# Altium schematic sheet led_array.schdoc
size 594 x 420 mm; Symbol: Drawing-Symbol_A4; Version: V1.0; Page Size: A4; Project: Bottle; @Update Date: 2026-04-30; @Create Date: 2026-03-28; Device: Drawing-Symbol_A4; @Board Name: Board1; @Page Name: P1; @Create Time: 21:02:32; @Page Count: 1; @Page No: 1; @Schematic Name: Schematic1; @Update Time: 21:02:32; @Assembly Variant: Basic; Border: 1; Title Block Position: 3; Size: A4; Width: 4676; Height: 3304; Region Start: 1; X Region Count: 6; Y Region Count: 4; Blade Width: 10; Title Block: 1; SheetNumber: 2; SheetTotal: 2
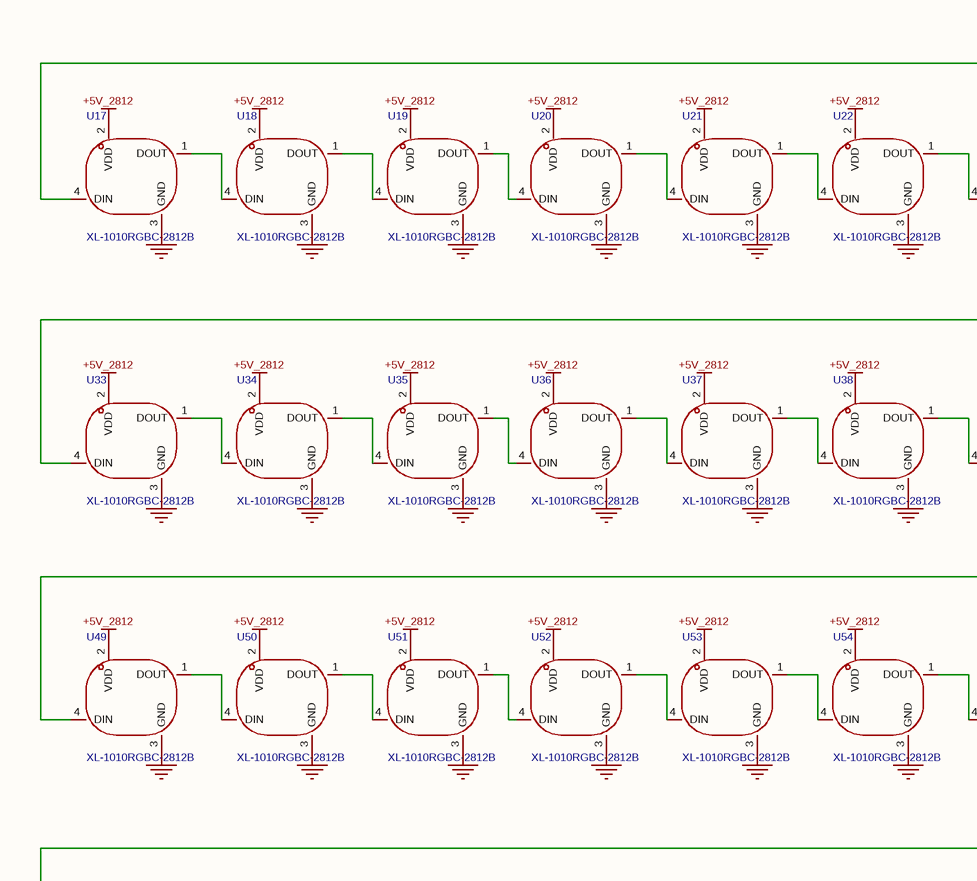
[diagram p0: led_array.schdoc, top left]
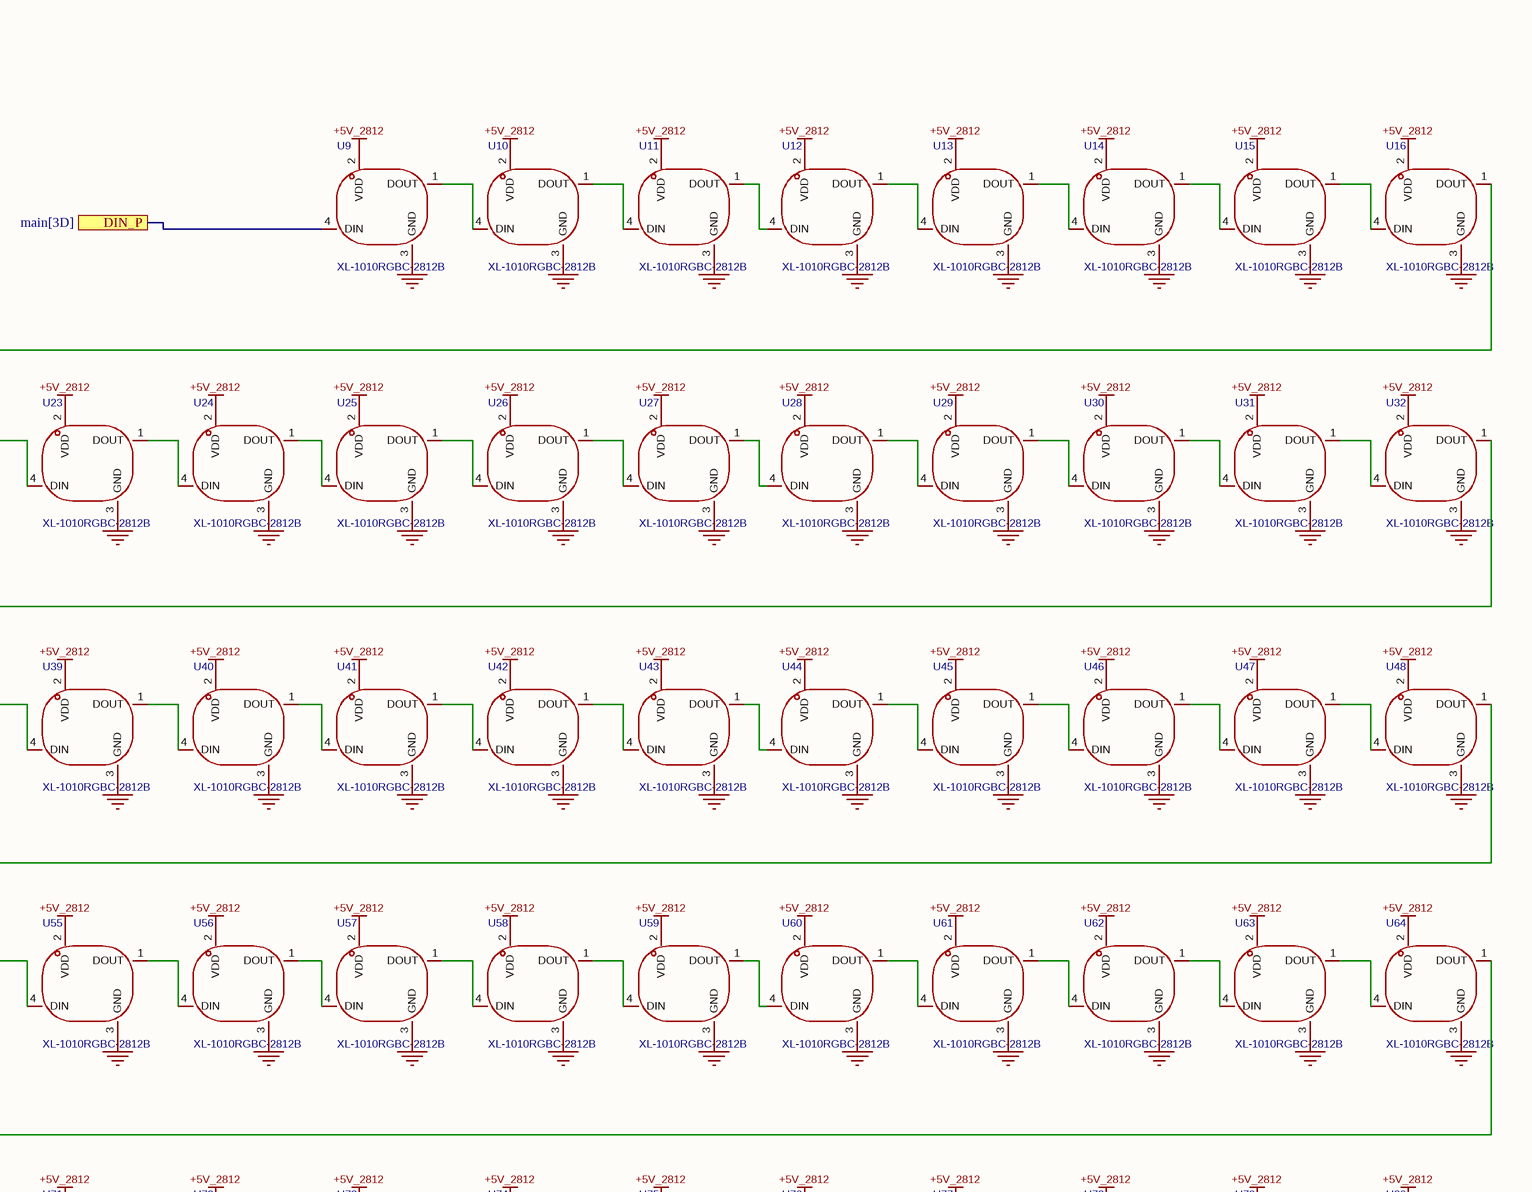
[diagram p1: led_array.schdoc, top right]
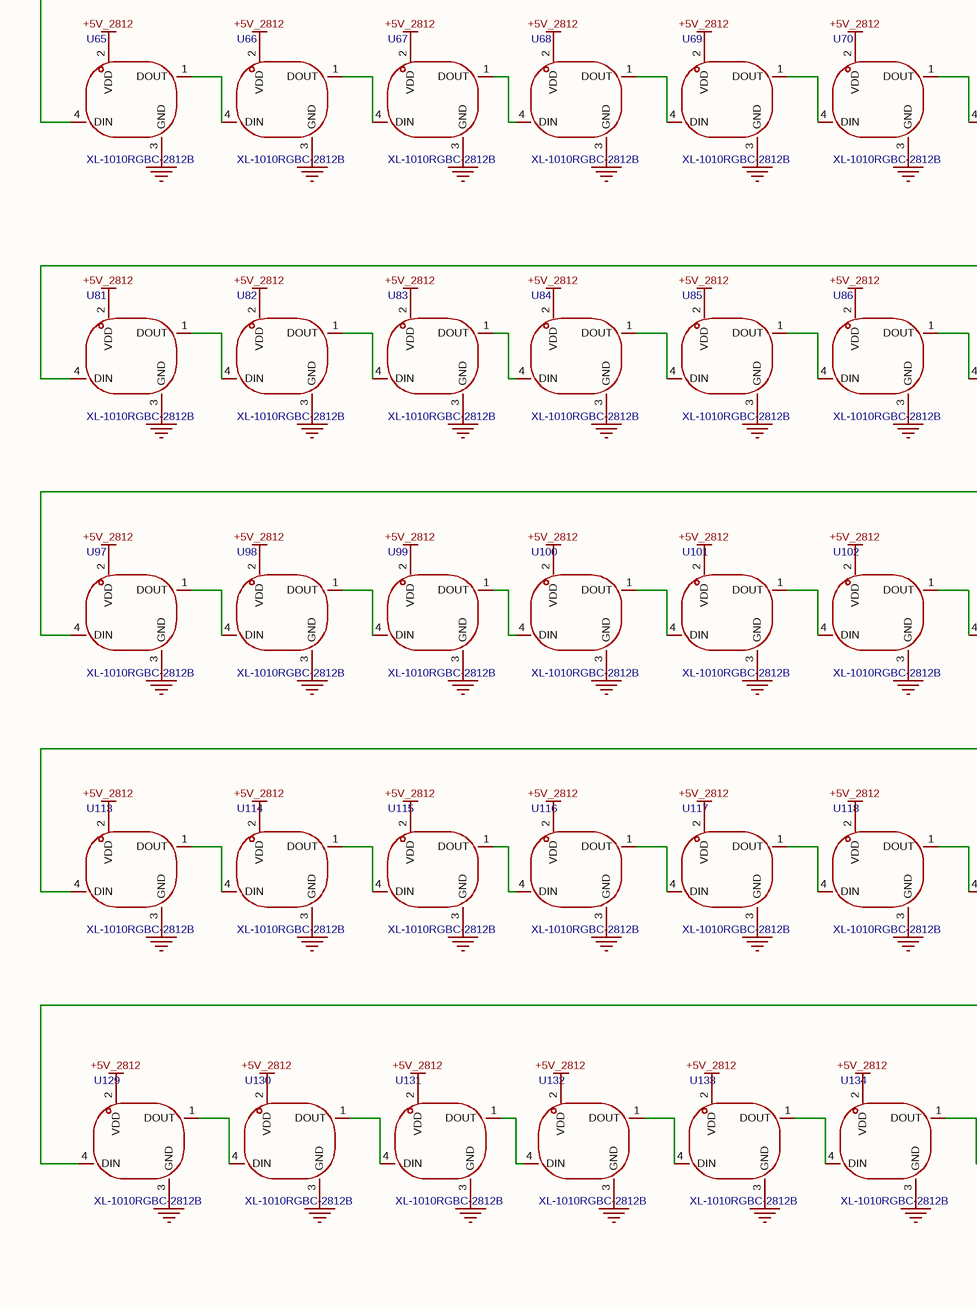
[diagram p2: led_array.schdoc, bottom left]
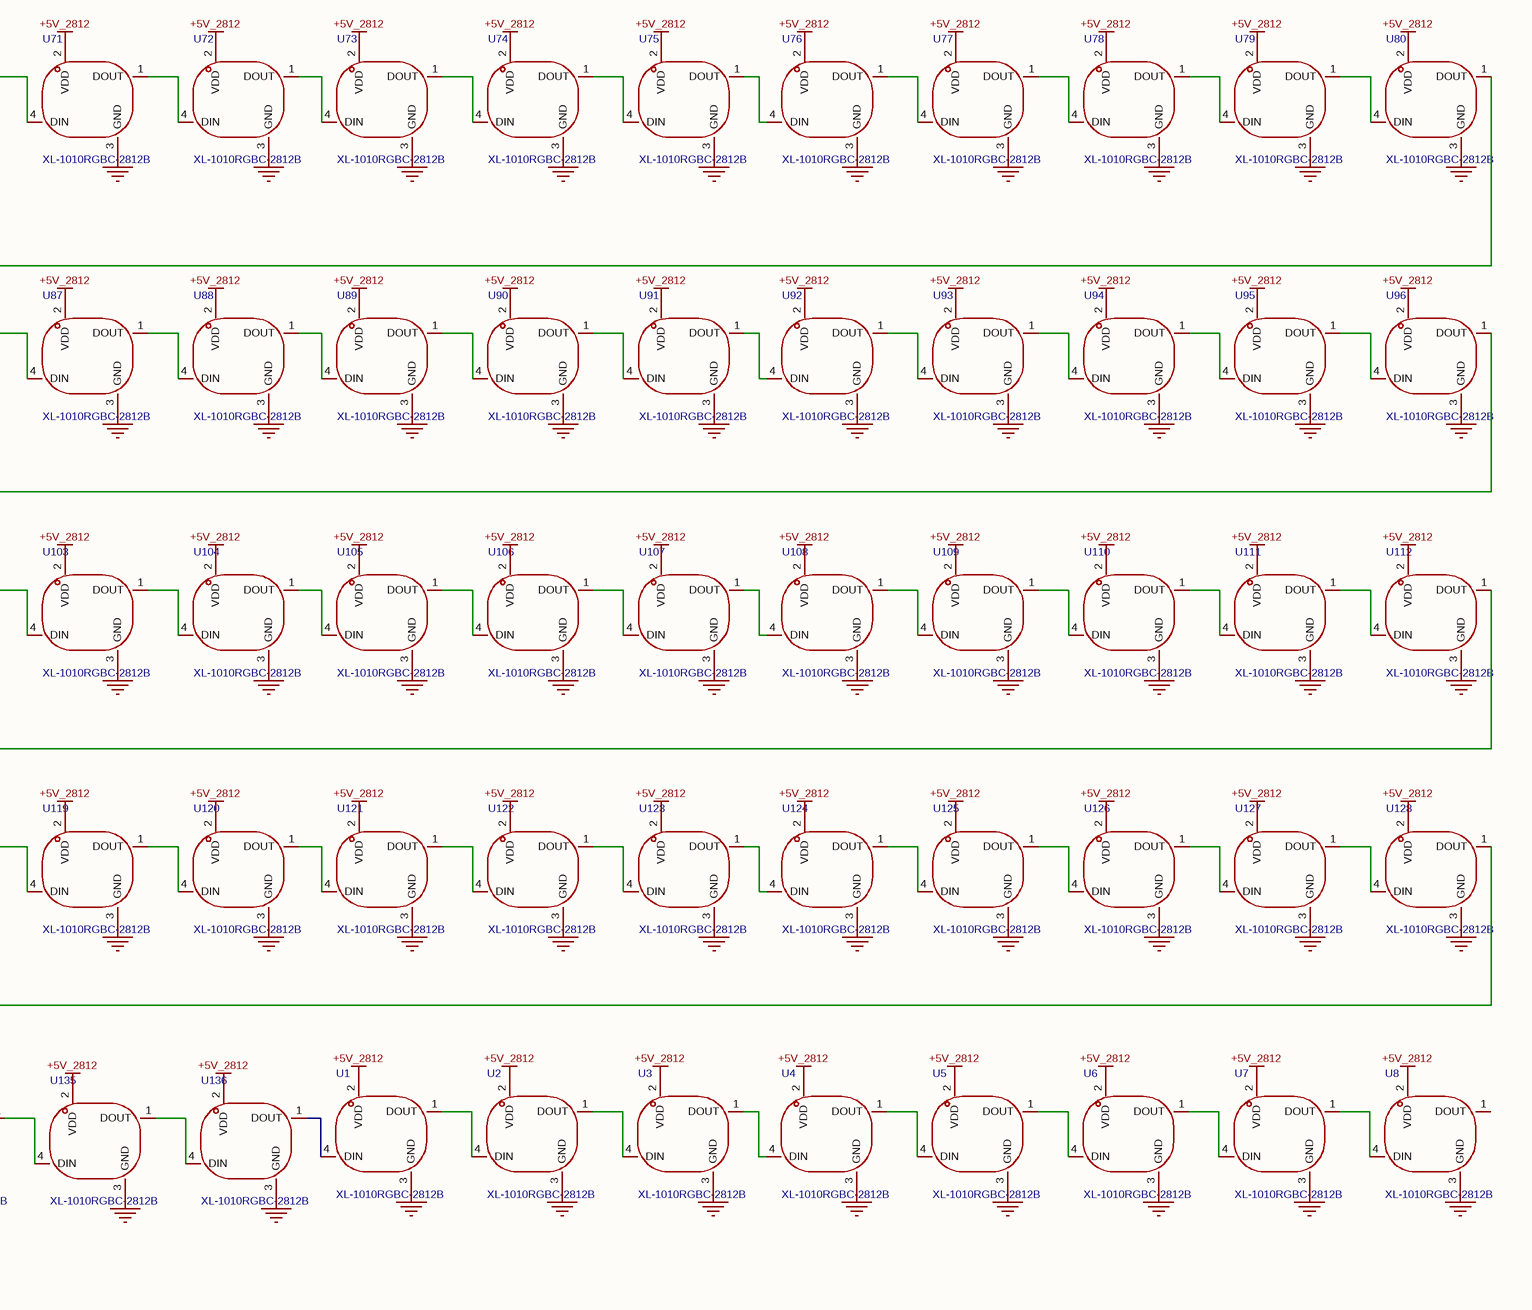
[diagram p3: led_array.schdoc, bottom right]

## Parts
U1  XL-1010RGBC-2812B  [LED-SMD_4P-L1.0-W1.0-TL_XL-1010RGBC-WS2812B]
U2  XL-1010RGBC-2812B  [LED-SMD_4P-L1.0-W1.0-TL_XL-1010RGBC-WS2812B]
U3  XL-1010RGBC-2812B  [LED-SMD_4P-L1.0-W1.0-TL_XL-1010RGBC-WS2812B]
U4  XL-1010RGBC-2812B  [LED-SMD_4P-L1.0-W1.0-TL_XL-1010RGBC-WS2812B]
U5  XL-1010RGBC-2812B  [LED-SMD_4P-L1.0-W1.0-TL_XL-1010RGBC-WS2812B]
U6  XL-1010RGBC-2812B  [LED-SMD_4P-L1.0-W1.0-TL_XL-1010RGBC-WS2812B]
U7  XL-1010RGBC-2812B  [LED-SMD_4P-L1.0-W1.0-TL_XL-1010RGBC-WS2812B]
U8  XL-1010RGBC-2812B  [LED-SMD_4P-L1.0-W1.0-TL_XL-1010RGBC-WS2812B]
U9  XL-1010RGBC-2812B  [LED-SMD_4P-L1.0-W1.0-TL_XL-1010RGBC-WS2812B]
U10  XL-1010RGBC-2812B  [LED-SMD_4P-L1.0-W1.0-TL_XL-1010RGBC-WS2812B]
U11  XL-1010RGBC-2812B  [LED-SMD_4P-L1.0-W1.0-TL_XL-1010RGBC-WS2812B]
U12  XL-1010RGBC-2812B  [LED-SMD_4P-L1.0-W1.0-TL_XL-1010RGBC-WS2812B]
U13  XL-1010RGBC-2812B  [LED-SMD_4P-L1.0-W1.0-TL_XL-1010RGBC-WS2812B]
U14  XL-1010RGBC-2812B  [LED-SMD_4P-L1.0-W1.0-TL_XL-1010RGBC-WS2812B]
U15  XL-1010RGBC-2812B  [LED-SMD_4P-L1.0-W1.0-TL_XL-1010RGBC-WS2812B]
U16  XL-1010RGBC-2812B  [LED-SMD_4P-L1.0-W1.0-TL_XL-1010RGBC-WS2812B]
U17  XL-1010RGBC-2812B  [LED-SMD_4P-L1.0-W1.0-TL_XL-1010RGBC-WS2812B]
U18  XL-1010RGBC-2812B  [LED-SMD_4P-L1.0-W1.0-TL_XL-1010RGBC-WS2812B]
U19  XL-1010RGBC-2812B  [LED-SMD_4P-L1.0-W1.0-TL_XL-1010RGBC-WS2812B]
U20  XL-1010RGBC-2812B  [LED-SMD_4P-L1.0-W1.0-TL_XL-1010RGBC-WS2812B]
U21  XL-1010RGBC-2812B  [LED-SMD_4P-L1.0-W1.0-TL_XL-1010RGBC-WS2812B]
U22  XL-1010RGBC-2812B  [LED-SMD_4P-L1.0-W1.0-TL_XL-1010RGBC-WS2812B]
U23  XL-1010RGBC-2812B  [LED-SMD_4P-L1.0-W1.0-TL_XL-1010RGBC-WS2812B]
U24  XL-1010RGBC-2812B  [LED-SMD_4P-L1.0-W1.0-TL_XL-1010RGBC-WS2812B]
U25  XL-1010RGBC-2812B  [LED-SMD_4P-L1.0-W1.0-TL_XL-1010RGBC-WS2812B]
U26  XL-1010RGBC-2812B  [LED-SMD_4P-L1.0-W1.0-TL_XL-1010RGBC-WS2812B]
U27  XL-1010RGBC-2812B  [LED-SMD_4P-L1.0-W1.0-TL_XL-1010RGBC-WS2812B]
U28  XL-1010RGBC-2812B  [LED-SMD_4P-L1.0-W1.0-TL_XL-1010RGBC-WS2812B]
U29  XL-1010RGBC-2812B  [LED-SMD_4P-L1.0-W1.0-TL_XL-1010RGBC-WS2812B]
U30  XL-1010RGBC-2812B  [LED-SMD_4P-L1.0-W1.0-TL_XL-1010RGBC-WS2812B]
U31  XL-1010RGBC-2812B  [LED-SMD_4P-L1.0-W1.0-TL_XL-1010RGBC-WS2812B]
U32  XL-1010RGBC-2812B  [LED-SMD_4P-L1.0-W1.0-TL_XL-1010RGBC-WS2812B]
U33  XL-1010RGBC-2812B  [LED-SMD_4P-L1.0-W1.0-TL_XL-1010RGBC-WS2812B]
U34  XL-1010RGBC-2812B  [LED-SMD_4P-L1.0-W1.0-TL_XL-1010RGBC-WS2812B]
U35  XL-1010RGBC-2812B  [LED-SMD_4P-L1.0-W1.0-TL_XL-1010RGBC-WS2812B]
U36  XL-1010RGBC-2812B  [LED-SMD_4P-L1.0-W1.0-TL_XL-1010RGBC-WS2812B]
U37  XL-1010RGBC-2812B  [LED-SMD_4P-L1.0-W1.0-TL_XL-1010RGBC-WS2812B]
U38  XL-1010RGBC-2812B  [LED-SMD_4P-L1.0-W1.0-TL_XL-1010RGBC-WS2812B]
U39  XL-1010RGBC-2812B  [LED-SMD_4P-L1.0-W1.0-TL_XL-1010RGBC-WS2812B]
U40  XL-1010RGBC-2812B  [LED-SMD_4P-L1.0-W1.0-TL_XL-1010RGBC-WS2812B]
U41  XL-1010RGBC-2812B  [LED-SMD_4P-L1.0-W1.0-TL_XL-1010RGBC-WS2812B]
U42  XL-1010RGBC-2812B  [LED-SMD_4P-L1.0-W1.0-TL_XL-1010RGBC-WS2812B]
U43  XL-1010RGBC-2812B  [LED-SMD_4P-L1.0-W1.0-TL_XL-1010RGBC-WS2812B]
U44  XL-1010RGBC-2812B  [LED-SMD_4P-L1.0-W1.0-TL_XL-1010RGBC-WS2812B]
U45  XL-1010RGBC-2812B  [LED-SMD_4P-L1.0-W1.0-TL_XL-1010RGBC-WS2812B]
U46  XL-1010RGBC-2812B  [LED-SMD_4P-L1.0-W1.0-TL_XL-1010RGBC-WS2812B]
U47  XL-1010RGBC-2812B  [LED-SMD_4P-L1.0-W1.0-TL_XL-1010RGBC-WS2812B]
U48  XL-1010RGBC-2812B  [LED-SMD_4P-L1.0-W1.0-TL_XL-1010RGBC-WS2812B]
U49  XL-1010RGBC-2812B  [LED-SMD_4P-L1.0-W1.0-TL_XL-1010RGBC-WS2812B]
U50  XL-1010RGBC-2812B  [LED-SMD_4P-L1.0-W1.0-TL_XL-1010RGBC-WS2812B]
U51  XL-1010RGBC-2812B  [LED-SMD_4P-L1.0-W1.0-TL_XL-1010RGBC-WS2812B]
U52  XL-1010RGBC-2812B  [LED-SMD_4P-L1.0-W1.0-TL_XL-1010RGBC-WS2812B]
U53  XL-1010RGBC-2812B  [LED-SMD_4P-L1.0-W1.0-TL_XL-1010RGBC-WS2812B]
U54  XL-1010RGBC-2812B  [LED-SMD_4P-L1.0-W1.0-TL_XL-1010RGBC-WS2812B]
U55  XL-1010RGBC-2812B  [LED-SMD_4P-L1.0-W1.0-TL_XL-1010RGBC-WS2812B]
U56  XL-1010RGBC-2812B  [LED-SMD_4P-L1.0-W1.0-TL_XL-1010RGBC-WS2812B]
U57  XL-1010RGBC-2812B  [LED-SMD_4P-L1.0-W1.0-TL_XL-1010RGBC-WS2812B]
U58  XL-1010RGBC-2812B  [LED-SMD_4P-L1.0-W1.0-TL_XL-1010RGBC-WS2812B]
U59  XL-1010RGBC-2812B  [LED-SMD_4P-L1.0-W1.0-TL_XL-1010RGBC-WS2812B]
U60  XL-1010RGBC-2812B  [LED-SMD_4P-L1.0-W1.0-TL_XL-1010RGBC-WS2812B]
U61  XL-1010RGBC-2812B  [LED-SMD_4P-L1.0-W1.0-TL_XL-1010RGBC-WS2812B]
U62  XL-1010RGBC-2812B  [LED-SMD_4P-L1.0-W1.0-TL_XL-1010RGBC-WS2812B]
U63  XL-1010RGBC-2812B  [LED-SMD_4P-L1.0-W1.0-TL_XL-1010RGBC-WS2812B]
U64  XL-1010RGBC-2812B  [LED-SMD_4P-L1.0-W1.0-TL_XL-1010RGBC-WS2812B]
U65  XL-1010RGBC-2812B  [LED-SMD_4P-L1.0-W1.0-TL_XL-1010RGBC-WS2812B]
U66  XL-1010RGBC-2812B  [LED-SMD_4P-L1.0-W1.0-TL_XL-1010RGBC-WS2812B]
U67  XL-1010RGBC-2812B  [LED-SMD_4P-L1.0-W1.0-TL_XL-1010RGBC-WS2812B]
U68  XL-1010RGBC-2812B  [LED-SMD_4P-L1.0-W1.0-TL_XL-1010RGBC-WS2812B]
U69  XL-1010RGBC-2812B  [LED-SMD_4P-L1.0-W1.0-TL_XL-1010RGBC-WS2812B]
U70  XL-1010RGBC-2812B  [LED-SMD_4P-L1.0-W1.0-TL_XL-1010RGBC-WS2812B]
U71  XL-1010RGBC-2812B  [LED-SMD_4P-L1.0-W1.0-TL_XL-1010RGBC-WS2812B]
U72  XL-1010RGBC-2812B  [LED-SMD_4P-L1.0-W1.0-TL_XL-1010RGBC-WS2812B]
U73  XL-1010RGBC-2812B  [LED-SMD_4P-L1.0-W1.0-TL_XL-1010RGBC-WS2812B]
U74  XL-1010RGBC-2812B  [LED-SMD_4P-L1.0-W1.0-TL_XL-1010RGBC-WS2812B]
U75  XL-1010RGBC-2812B  [LED-SMD_4P-L1.0-W1.0-TL_XL-1010RGBC-WS2812B]
U76  XL-1010RGBC-2812B  [LED-SMD_4P-L1.0-W1.0-TL_XL-1010RGBC-WS2812B]
U77  XL-1010RGBC-2812B  [LED-SMD_4P-L1.0-W1.0-TL_XL-1010RGBC-WS2812B]
U78  XL-1010RGBC-2812B  [LED-SMD_4P-L1.0-W1.0-TL_XL-1010RGBC-WS2812B]
U79  XL-1010RGBC-2812B  [LED-SMD_4P-L1.0-W1.0-TL_XL-1010RGBC-WS2812B]
U80  XL-1010RGBC-2812B  [LED-SMD_4P-L1.0-W1.0-TL_XL-1010RGBC-WS2812B]
U81  XL-1010RGBC-2812B  [LED-SMD_4P-L1.0-W1.0-TL_XL-1010RGBC-WS2812B]
U82  XL-1010RGBC-2812B  [LED-SMD_4P-L1.0-W1.0-TL_XL-1010RGBC-WS2812B]
U83  XL-1010RGBC-2812B  [LED-SMD_4P-L1.0-W1.0-TL_XL-1010RGBC-WS2812B]
U84  XL-1010RGBC-2812B  [LED-SMD_4P-L1.0-W1.0-TL_XL-1010RGBC-WS2812B]
U85  XL-1010RGBC-2812B  [LED-SMD_4P-L1.0-W1.0-TL_XL-1010RGBC-WS2812B]
U86  XL-1010RGBC-2812B  [LED-SMD_4P-L1.0-W1.0-TL_XL-1010RGBC-WS2812B]
U87  XL-1010RGBC-2812B  [LED-SMD_4P-L1.0-W1.0-TL_XL-1010RGBC-WS2812B]
U88  XL-1010RGBC-2812B  [LED-SMD_4P-L1.0-W1.0-TL_XL-1010RGBC-WS2812B]
U89  XL-1010RGBC-2812B  [LED-SMD_4P-L1.0-W1.0-TL_XL-1010RGBC-WS2812B]
U90  XL-1010RGBC-2812B  [LED-SMD_4P-L1.0-W1.0-TL_XL-1010RGBC-WS2812B]
U91  XL-1010RGBC-2812B  [LED-SMD_4P-L1.0-W1.0-TL_XL-1010RGBC-WS2812B]
U92  XL-1010RGBC-2812B  [LED-SMD_4P-L1.0-W1.0-TL_XL-1010RGBC-WS2812B]
U93  XL-1010RGBC-2812B  [LED-SMD_4P-L1.0-W1.0-TL_XL-1010RGBC-WS2812B]
U94  XL-1010RGBC-2812B  [LED-SMD_4P-L1.0-W1.0-TL_XL-1010RGBC-WS2812B]
U95  XL-1010RGBC-2812B  [LED-SMD_4P-L1.0-W1.0-TL_XL-1010RGBC-WS2812B]
U96  XL-1010RGBC-2812B  [LED-SMD_4P-L1.0-W1.0-TL_XL-1010RGBC-WS2812B]
U97  XL-1010RGBC-2812B  [LED-SMD_4P-L1.0-W1.0-TL_XL-1010RGBC-WS2812B]
U98  XL-1010RGBC-2812B  [LED-SMD_4P-L1.0-W1.0-TL_XL-1010RGBC-WS2812B]
U99  XL-1010RGBC-2812B  [LED-SMD_4P-L1.0-W1.0-TL_XL-1010RGBC-WS2812B]
U100  XL-1010RGBC-2812B  [LED-SMD_4P-L1.0-W1.0-TL_XL-1010RGBC-WS2812B]
U101  XL-1010RGBC-2812B  [LED-SMD_4P-L1.0-W1.0-TL_XL-1010RGBC-WS2812B]
U102  XL-1010RGBC-2812B  [LED-SMD_4P-L1.0-W1.0-TL_XL-1010RGBC-WS2812B]
U103  XL-1010RGBC-2812B  [LED-SMD_4P-L1.0-W1.0-TL_XL-1010RGBC-WS2812B]
U104  XL-1010RGBC-2812B  [LED-SMD_4P-L1.0-W1.0-TL_XL-1010RGBC-WS2812B]
U105  XL-1010RGBC-2812B  [LED-SMD_4P-L1.0-W1.0-TL_XL-1010RGBC-WS2812B]
U106  XL-1010RGBC-2812B  [LED-SMD_4P-L1.0-W1.0-TL_XL-1010RGBC-WS2812B]
U107  XL-1010RGBC-2812B  [LED-SMD_4P-L1.0-W1.0-TL_XL-1010RGBC-WS2812B]
U108  XL-1010RGBC-2812B  [LED-SMD_4P-L1.0-W1.0-TL_XL-1010RGBC-WS2812B]
U109  XL-1010RGBC-2812B  [LED-SMD_4P-L1.0-W1.0-TL_XL-1010RGBC-WS2812B]
U110  XL-1010RGBC-2812B  [LED-SMD_4P-L1.0-W1.0-TL_XL-1010RGBC-WS2812B]
U111  XL-1010RGBC-2812B  [LED-SMD_4P-L1.0-W1.0-TL_XL-1010RGBC-WS2812B]
U112  XL-1010RGBC-2812B  [LED-SMD_4P-L1.0-W1.0-TL_XL-1010RGBC-WS2812B]
U113  XL-1010RGBC-2812B  [LED-SMD_4P-L1.0-W1.0-TL_XL-1010RGBC-WS2812B]
U114  XL-1010RGBC-2812B  [LED-SMD_4P-L1.0-W1.0-TL_XL-1010RGBC-WS2812B]
U115  XL-1010RGBC-2812B  [LED-SMD_4P-L1.0-W1.0-TL_XL-1010RGBC-WS2812B]
U116  XL-1010RGBC-2812B  [LED-SMD_4P-L1.0-W1.0-TL_XL-1010RGBC-WS2812B]
U117  XL-1010RGBC-2812B  [LED-SMD_4P-L1.0-W1.0-TL_XL-1010RGBC-WS2812B]
U118  XL-1010RGBC-2812B  [LED-SMD_4P-L1.0-W1.0-TL_XL-1010RGBC-WS2812B]
U119  XL-1010RGBC-2812B  [LED-SMD_4P-L1.0-W1.0-TL_XL-1010RGBC-WS2812B]
U120  XL-1010RGBC-2812B  [LED-SMD_4P-L1.0-W1.0-TL_XL-1010RGBC-WS2812B]
U121  XL-1010RGBC-2812B  [LED-SMD_4P-L1.0-W1.0-TL_XL-1010RGBC-WS2812B]
U122  XL-1010RGBC-2812B  [LED-SMD_4P-L1.0-W1.0-TL_XL-1010RGBC-WS2812B]
U123  XL-1010RGBC-2812B  [LED-SMD_4P-L1.0-W1.0-TL_XL-1010RGBC-WS2812B]
U124  XL-1010RGBC-2812B  [LED-SMD_4P-L1.0-W1.0-TL_XL-1010RGBC-WS2812B]
U125  XL-1010RGBC-2812B  [LED-SMD_4P-L1.0-W1.0-TL_XL-1010RGBC-WS2812B]
U126  XL-1010RGBC-2812B  [LED-SMD_4P-L1.0-W1.0-TL_XL-1010RGBC-WS2812B]
U127  XL-1010RGBC-2812B  [LED-SMD_4P-L1.0-W1.0-TL_XL-1010RGBC-WS2812B]
U128  XL-1010RGBC-2812B  [LED-SMD_4P-L1.0-W1.0-TL_XL-1010RGBC-WS2812B]
U129  XL-1010RGBC-2812B  [LED-SMD_4P-L1.0-W1.0-TL_XL-1010RGBC-WS2812B]
U130  XL-1010RGBC-2812B  [LED-SMD_4P-L1.0-W1.0-TL_XL-1010RGBC-WS2812B]
U131  XL-1010RGBC-2812B  [LED-SMD_4P-L1.0-W1.0-TL_XL-1010RGBC-WS2812B]
U132  XL-1010RGBC-2812B  [LED-SMD_4P-L1.0-W1.0-TL_XL-1010RGBC-WS2812B]
U133  XL-1010RGBC-2812B  [LED-SMD_4P-L1.0-W1.0-TL_XL-1010RGBC-WS2812B]
U134  XL-1010RGBC-2812B  [LED-SMD_4P-L1.0-W1.0-TL_XL-1010RGBC-WS2812B]
U135  XL-1010RGBC-2812B  [LED-SMD_4P-L1.0-W1.0-TL_XL-1010RGBC-WS2812B]
U136  XL-1010RGBC-2812B  [LED-SMD_4P-L1.0-W1.0-TL_XL-1010RGBC-WS2812B]

## Ports
DIN_P (see main[3D])

## Nets
+5V_2812: U1.2(VDD) U2.2(VDD) U3.2(VDD) U4.2(VDD) U5.2(VDD) U6.2(VDD) U7.2(VDD) U8.2(VDD) U9.2(VDD) U10.2(VDD) U11.2(VDD) U12.2(VDD) U13.2(VDD) U14.2(VDD) U15.2(VDD) U16.2(VDD) U17.2(VDD) U18.2(VDD) U19.2(VDD) U20.2(VDD) U21.2(VDD) U22.2(VDD) U23.2(VDD) U24.2(VDD) U25.2(VDD) U26.2(VDD) U27.2(VDD) U28.2(VDD) U29.2(VDD) U30.2(VDD) U31.2(VDD) U32.2(VDD) U33.2(VDD) U34.2(VDD) U35.2(VDD) U36.2(VDD) U37.2(VDD) U38.2(VDD) U39.2(VDD) U40.2(VDD) U41.2(VDD) U42.2(VDD) U43.2(VDD) U44.2(VDD) U45.2(VDD) U46.2(VDD) U47.2(VDD) U48.2(VDD) U49.2(VDD) U50.2(VDD) U51.2(VDD) U52.2(VDD) U53.2(VDD) U54.2(VDD) U55.2(VDD) U56.2(VDD) U57.2(VDD) U58.2(VDD) U59.2(VDD) U60.2(VDD) U61.2(VDD) U62.2(VDD) U63.2(VDD) U64.2(VDD) U65.2(VDD) U66.2(VDD) U67.2(VDD) U68.2(VDD) U69.2(VDD) U70.2(VDD) U71.2(VDD) U72.2(VDD) U73.2(VDD) U74.2(VDD) U75.2(VDD) U76.2(VDD) U77.2(VDD) U78.2(VDD) U79.2(VDD) U80.2(VDD) U81.2(VDD) U82.2(VDD) U83.2(VDD) U84.2(VDD) U85.2(VDD) U86.2(VDD) U87.2(VDD) U88.2(VDD) U89.2(VDD) U90.2(VDD) U91.2(VDD) U92.2(VDD) U93.2(VDD) U94.2(VDD) U95.2(VDD) U96.2(VDD) U97.2(VDD) U98.2(VDD) U99.2(VDD) U100.2(VDD) U101.2(VDD) U102.2(VDD) U103.2(VDD) U104.2(VDD) U105.2(VDD) U106.2(VDD) U107.2(VDD) U108.2(VDD) U109.2(VDD) U110.2(VDD) U111.2(VDD) U112.2(VDD) U113.2(VDD) U114.2(VDD) U115.2(VDD) U116.2(VDD) U117.2(VDD) U118.2(VDD) U119.2(VDD) U120.2(VDD) U121.2(VDD) U122.2(VDD) U123.2(VDD) U124.2(VDD) U125.2(VDD) U126.2(VDD) U127.2(VDD) U128.2(VDD) U129.2(VDD) U130.2(VDD) U131.2(VDD) U132.2(VDD) U133.2(VDD) U134.2(VDD) U135.2(VDD) U136.2(VDD)
GND: U1.3(GND) U2.3(GND) U3.3(GND) U4.3(GND) U5.3(GND) U6.3(GND) U7.3(GND) U8.3(GND) U9.3(GND) U10.3(GND) U11.3(GND) U12.3(GND) U13.3(GND) U14.3(GND) U15.3(GND) U16.3(GND) U17.3(GND) U18.3(GND) U19.3(GND) U20.3(GND) U21.3(GND) U22.3(GND) U23.3(GND) U24.3(GND) U25.3(GND) U26.3(GND) U27.3(GND) U28.3(GND) U29.3(GND) U30.3(GND) U31.3(GND) U32.3(GND) U33.3(GND) U34.3(GND) U35.3(GND) U36.3(GND) U37.3(GND) U38.3(GND) U39.3(GND) U40.3(GND) U41.3(GND) U42.3(GND) U43.3(GND) U44.3(GND) U45.3(GND) U46.3(GND) U47.3(GND) U48.3(GND) U49.3(GND) U50.3(GND) U51.3(GND) U52.3(GND) U53.3(GND) U54.3(GND) U55.3(GND) U56.3(GND) U57.3(GND) U58.3(GND) U59.3(GND) U60.3(GND) U61.3(GND) U62.3(GND) U63.3(GND) U64.3(GND) U65.3(GND) U66.3(GND) U67.3(GND) U68.3(GND) U69.3(GND) U70.3(GND) U71.3(GND) U72.3(GND) U73.3(GND) U74.3(GND) U75.3(GND) U76.3(GND) U77.3(GND) U78.3(GND) U79.3(GND) U80.3(GND) U81.3(GND) U82.3(GND) U83.3(GND) U84.3(GND) U85.3(GND) U86.3(GND) U87.3(GND) U88.3(GND) U89.3(GND) U90.3(GND) U91.3(GND) U92.3(GND) U93.3(GND) U94.3(GND) U95.3(GND) U96.3(GND) U97.3(GND) U98.3(GND) U99.3(GND) U100.3(GND) U101.3(GND) U102.3(GND) U103.3(GND) U104.3(GND) U105.3(GND) U106.3(GND) U107.3(GND) U108.3(GND) U109.3(GND) U110.3(GND) U111.3(GND) U112.3(GND) U113.3(GND) U114.3(GND) U115.3(GND) U116.3(GND) U117.3(GND) U118.3(GND) U119.3(GND) U120.3(GND) U121.3(GND) U122.3(GND) U123.3(GND) U124.3(GND) U125.3(GND) U126.3(GND) U127.3(GND) U128.3(GND) U129.3(GND) U130.3(GND) U131.3(GND) U132.3(GND) U133.3(GND) U134.3(GND) U135.3(GND) U136.3(GND)
DIN_P: U9.4(DIN) ; port DIN_P
NetU1_1: U1.1(DOUT) U2.4(DIN)
NetU1_4: U1.4(DIN) U136.1(DOUT)
NetU2_1: U2.1(DOUT) U3.4(DIN)
NetU3_1: U3.1(DOUT) U4.4(DIN)
NetU4_1: U4.1(DOUT) U5.4(DIN)
NetU5_1: U5.1(DOUT) U6.4(DIN)
NetU6_1: U6.1(DOUT) U7.4(DIN)
NetU7_1: U7.1(DOUT) U8.4(DIN)
NetU9_1: U9.1(DOUT) U10.4(DIN)
NetU10_1: U10.1(DOUT) U11.4(DIN)
NetU11_1: U11.1(DOUT) U12.4(DIN)
NetU12_1: U12.1(DOUT) U13.4(DIN)
NetU13_1: U13.1(DOUT) U14.4(DIN)
NetU14_1: U14.1(DOUT) U15.4(DIN)
NetU15_1: U15.1(DOUT) U16.4(DIN)
NetU16_1: U16.1(DOUT) U17.4(DIN)
NetU17_1: U17.1(DOUT) U18.4(DIN)
NetU18_1: U18.1(DOUT) U19.4(DIN)
NetU19_1: U19.1(DOUT) U20.4(DIN)
NetU20_1: U20.1(DOUT) U21.4(DIN)
NetU21_1: U21.1(DOUT) U22.4(DIN)
NetU22_1: U22.1(DOUT) U23.4(DIN)
NetU23_1: U23.1(DOUT) U24.4(DIN)
NetU24_1: U24.1(DOUT) U25.4(DIN)
NetU25_1: U25.1(DOUT) U26.4(DIN)
NetU26_1: U26.1(DOUT) U27.4(DIN)
NetU27_1: U27.1(DOUT) U28.4(DIN)
NetU28_1: U28.1(DOUT) U29.4(DIN)
NetU29_1: U29.1(DOUT) U30.4(DIN)
NetU30_1: U30.1(DOUT) U31.4(DIN)
NetU31_1: U31.1(DOUT) U32.4(DIN)
NetU32_1: U32.1(DOUT) U33.4(DIN)
NetU33_1: U33.1(DOUT) U34.4(DIN)
NetU34_1: U34.1(DOUT) U35.4(DIN)
NetU35_1: U35.1(DOUT) U36.4(DIN)
NetU36_1: U36.1(DOUT) U37.4(DIN)
NetU37_1: U37.1(DOUT) U38.4(DIN)
NetU38_1: U38.1(DOUT) U39.4(DIN)
NetU39_1: U39.1(DOUT) U40.4(DIN)
NetU40_1: U40.1(DOUT) U41.4(DIN)
NetU41_1: U41.1(DOUT) U42.4(DIN)
NetU42_1: U42.1(DOUT) U43.4(DIN)
NetU43_1: U43.1(DOUT) U44.4(DIN)
NetU44_1: U44.1(DOUT) U45.4(DIN)
NetU45_1: U45.1(DOUT) U46.4(DIN)
NetU46_1: U46.1(DOUT) U47.4(DIN)
NetU47_1: U47.1(DOUT) U48.4(DIN)
NetU48_1: U48.1(DOUT) U49.4(DIN)
NetU49_1: U49.1(DOUT) U50.4(DIN)
NetU50_1: U50.1(DOUT) U51.4(DIN)
NetU51_1: U51.1(DOUT) U52.4(DIN)
NetU52_1: U52.1(DOUT) U53.4(DIN)
NetU53_1: U53.1(DOUT) U54.4(DIN)
NetU54_1: U54.1(DOUT) U55.4(DIN)
NetU55_1: U55.1(DOUT) U56.4(DIN)
NetU56_1: U56.1(DOUT) U57.4(DIN)
NetU57_1: U57.1(DOUT) U58.4(DIN)
NetU58_1: U58.1(DOUT) U59.4(DIN)
NetU59_1: U59.1(DOUT) U60.4(DIN)
NetU60_1: U60.1(DOUT) U61.4(DIN)
NetU61_1: U61.1(DOUT) U62.4(DIN)
NetU62_1: U62.1(DOUT) U63.4(DIN)
NetU63_1: U63.1(DOUT) U64.4(DIN)
NetU64_1: U64.1(DOUT) U65.4(DIN)
NetU65_1: U65.1(DOUT) U66.4(DIN)
NetU66_1: U66.1(DOUT) U67.4(DIN)
NetU67_1: U67.1(DOUT) U68.4(DIN)
NetU68_1: U68.1(DOUT) U69.4(DIN)
NetU69_1: U69.1(DOUT) U70.4(DIN)
NetU70_1: U70.1(DOUT) U71.4(DIN)
NetU71_1: U71.1(DOUT) U72.4(DIN)
NetU72_1: U72.1(DOUT) U73.4(DIN)
NetU73_1: U73.1(DOUT) U74.4(DIN)
NetU74_1: U74.1(DOUT) U75.4(DIN)
NetU75_1: U75.1(DOUT) U76.4(DIN)
NetU76_1: U76.1(DOUT) U77.4(DIN)
NetU77_1: U77.1(DOUT) U78.4(DIN)
NetU78_1: U78.1(DOUT) U79.4(DIN)
NetU79_1: U79.1(DOUT) U80.4(DIN)
NetU80_1: U80.1(DOUT) U81.4(DIN)
NetU81_1: U81.1(DOUT) U82.4(DIN)
NetU82_1: U82.1(DOUT) U83.4(DIN)
NetU83_1: U83.1(DOUT) U84.4(DIN)
NetU84_1: U84.1(DOUT) U85.4(DIN)
NetU85_1: U85.1(DOUT) U86.4(DIN)
NetU86_1: U86.1(DOUT) U87.4(DIN)
NetU87_1: U87.1(DOUT) U88.4(DIN)
NetU88_1: U88.1(DOUT) U89.4(DIN)
NetU89_1: U89.1(DOUT) U90.4(DIN)
NetU90_1: U90.1(DOUT) U91.4(DIN)
NetU91_1: U91.1(DOUT) U92.4(DIN)
NetU92_1: U92.1(DOUT) U93.4(DIN)
NetU93_1: U93.1(DOUT) U94.4(DIN)
NetU94_1: U94.1(DOUT) U95.4(DIN)
NetU95_1: U95.1(DOUT) U96.4(DIN)
NetU96_1: U96.1(DOUT) U97.4(DIN)
NetU97_1: U97.1(DOUT) U98.4(DIN)
NetU98_1: U98.1(DOUT) U99.4(DIN)
NetU99_1: U99.1(DOUT) U100.4(DIN)
NetU100_1: U100.1(DOUT) U101.4(DIN)
NetU101_1: U101.1(DOUT) U102.4(DIN)
NetU102_1: U102.1(DOUT) U103.4(DIN)
NetU103_1: U103.1(DOUT) U104.4(DIN)
NetU104_1: U104.1(DOUT) U105.4(DIN)
NetU105_1: U105.1(DOUT) U106.4(DIN)
NetU106_1: U106.1(DOUT) U107.4(DIN)
NetU107_1: U107.1(DOUT) U108.4(DIN)
NetU108_1: U108.1(DOUT) U109.4(DIN)
NetU109_1: U109.1(DOUT) U110.4(DIN)
NetU110_1: U110.1(DOUT) U111.4(DIN)
NetU111_1: U111.1(DOUT) U112.4(DIN)
NetU112_1: U112.1(DOUT) U113.4(DIN)
NetU113_1: U113.1(DOUT) U114.4(DIN)
NetU114_1: U114.1(DOUT) U115.4(DIN)
NetU115_1: U115.1(DOUT) U116.4(DIN)
NetU116_1: U116.1(DOUT) U117.4(DIN)
NetU117_1: U117.1(DOUT) U118.4(DIN)
NetU118_1: U118.1(DOUT) U119.4(DIN)
NetU119_1: U119.1(DOUT) U120.4(DIN)
NetU120_1: U120.1(DOUT) U121.4(DIN)
NetU121_1: U121.1(DOUT) U122.4(DIN)
NetU122_1: U122.1(DOUT) U123.4(DIN)
NetU123_1: U123.1(DOUT) U124.4(DIN)
NetU124_1: U124.1(DOUT) U125.4(DIN)
NetU125_1: U125.1(DOUT) U126.4(DIN)
NetU126_1: U126.1(DOUT) U127.4(DIN)
NetU127_1: U127.1(DOUT) U128.4(DIN)
NetU128_1: U128.1(DOUT) U129.4(DIN)
NetU129_1: U129.1(DOUT) U130.4(DIN)
NetU130_1: U130.1(DOUT) U131.4(DIN)
NetU131_1: U131.1(DOUT) U132.4(DIN)
NetU132_1: U132.1(DOUT) U133.4(DIN)
NetU133_1: U133.1(DOUT) U134.4(DIN)
NetU134_1: U134.1(DOUT) U135.4(DIN)
NetU135_1: U135.1(DOUT) U136.4(DIN)

Not connected (* = marked no-connect by the designer): U8 1(DOUT)

## Notes on the sheet
- DWG NO:
- REV:
- THIS DOCUMENT AND THE DATA DISCLOSED HEREIN OR
- HEREWITH IS THE PROPERTY OF ALTIUM LIMITED AND MAY
- BE FREELY DISTRIBUTED IN WHOLE. NO RIGHTS ARE
- RESERVED OR EXPRESS OR IMPLIED WARANTEE GIVEN.
- REVISION
- DESCRIPTION
- DATE
- APPROVED
- ENG:
- APPROVALS
- PROJECT
- DSN:
- CHK:
- REFERENCE DOCUMENTS
- PROJECT REVISION:
- TITLE
- DOCUMENT REVISION:
- DESIGN ITEM:
- BOM:
- FAB DWG:
- PCB DWG:
- ASSY DWG:
- SCALE:
- A2
- SIZE
- CAGE CODE
- FILE NAME
- DWG NO.
- SHEET
- OF
- REV

## Library data of the parts
U1-U136 = XL-1010RGBC-2812B: 0404幻彩透明  内置驱动IC    WS2812B; Manufacturer: XINGLIGHT(成兴光); Symbol: XL-1010RGBC-WS2812B; AddInBom: yes; ModelId: b6fa6106de37409d87b62d9524377e1c聨0819f05c4eef4c71ace90d822a990e87; ModelTransform: 39.37,39.40937,0,0,0,0,0,0,0; Wavelength: 620nm~625nm；465nm~475nm；520nm~530nm; Luminous Intensity: 300mcd；800mcd；200mcd; Fixed-Frequency Pwm Mode: 1kHz; Data Transmission Rate: 800Kbit/s; Voltage - Supply: 4.5V~5.5V; Quiescent Current: 0.35mA; Lens Color: 无色透明透镜; ESD Withstand Voltage: 2000V; Installation method: 正贴; Peak Wavelength: R:625nm；B:470nm；G:525nm; Viewing Angle: 120°; Device: XL-1010RGBC-2812B; LCSC Part Name: XL-1010RGBC-WS2812B; SupplierPart: C5349953; ManufacturerPart: XL-1010RGBC-2812B; Supplier Footprint: SMD,1x1mm; JLCPCB Part Class: Extended Part; Datasheet: https://item.szlcsc.com/datasheet/XL-1010RGBC-2812B/6136402.html; Supplier: LCSC; ConvertToPcb: yes; FootprintName: LED-SMD_4P-L1.0-W1.0-TL_XL-1010RGBC-WS2812B; ModelName: LED-SMD_4P-L1.0-W1.0-TL_XL-1010RGBC-WS2812B; Operating Temperature: -20℃~+85℃; Length: 1mm; Width: 0.8mm; Height: 1mm